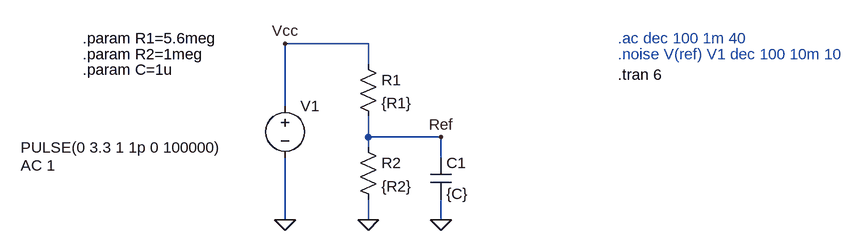
[diagram p0: schematic divider.asc]
divider.asc, the LTspice schematic file:
Version 4
SHEET 1 904 680
WIRE 144 32 16 32
WIRE 144 64 144 32
WIRE 16 128 16 32
WIRE 144 176 144 144
WIRE 256 176 144 176
WIRE 144 192 144 176
WIRE 256 208 256 176
WIRE 16 304 16 208
WIRE 144 304 144 272
WIRE 256 304 256 272
FLAG 256 304 0
FLAG 144 304 0
FLAG 16 304 0
FLAG 256 176 Ref
FLAG 16 32 Vcc
SYMBOL voltage 16 112 R0
WINDOW 3 -407 80 Left 2
WINDOW 123 -407 108 Left 2
WINDOW 39 0 0 Left 0
SYMATTR Value PULSE(0 3.3 1 1p 0 100000)
SYMATTR Value2 AC 1
SYMATTR InstName V1
SYMBOL res 128 48 R0
SYMATTR InstName R1
SYMATTR Value {R1}
SYMBOL res 128 176 R0
SYMATTR InstName R2
SYMATTR Value {R2}
SYMBOL cap 240 208 R0
SYMATTR InstName C1
SYMATTR Value {C}
TEXT -296 24 Left 2 !.param R1=5.6meg
TEXT -296 48 Left 2 !.param R2=1meg
TEXT -296 72 Left 2 !.param C=1u
TEXT 528 24 Left 2 ;.ac dec 100 1m 40
TEXT 528 80 Left 2 !.tran 6
TEXT 528 48 Left 2 ;.noise V(ref) V1 dec 100 10m 10

The netlist it stands for:
* divider.asc
V1 Vcc 0 PULSE(0 3.3 1 1p 0 100000) AC 1
R1 Vcc Ref {R1}
R2 Ref 0 {R2}
C1 Ref 0 {C}
.param R1=5.6meg
.param R2=1meg
.param C=1u
* .ac dec 100 1m 40
.tran 6
* .noise V(ref) V1 dec 100 10m 10
.backanno
.end

* Results of the author's LTspice run, read from the files saved beside the schematic
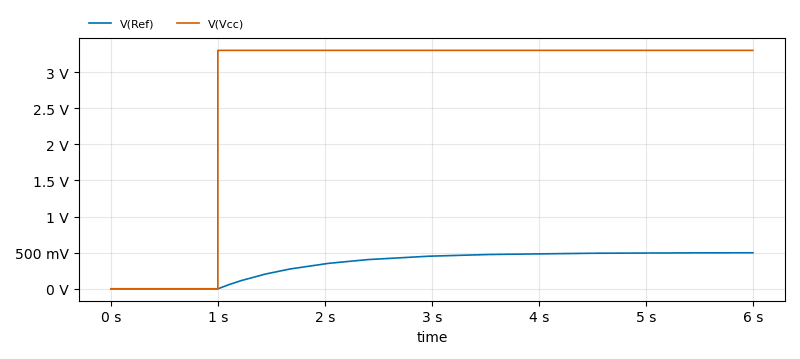
[diagram p1: Transient Analysis of divider.asc, plotted from the saved traces]
* Transient Analysis, 1 run:
*   V(Ref): min 0 V, max 498.6 mV, average 345 mV, rms 393.5 mV, last 498.6 mV
*   V(Vcc): min 0 V, max 3.3 V, average 2.75 V, rms 3.012 V, last 3.3 V